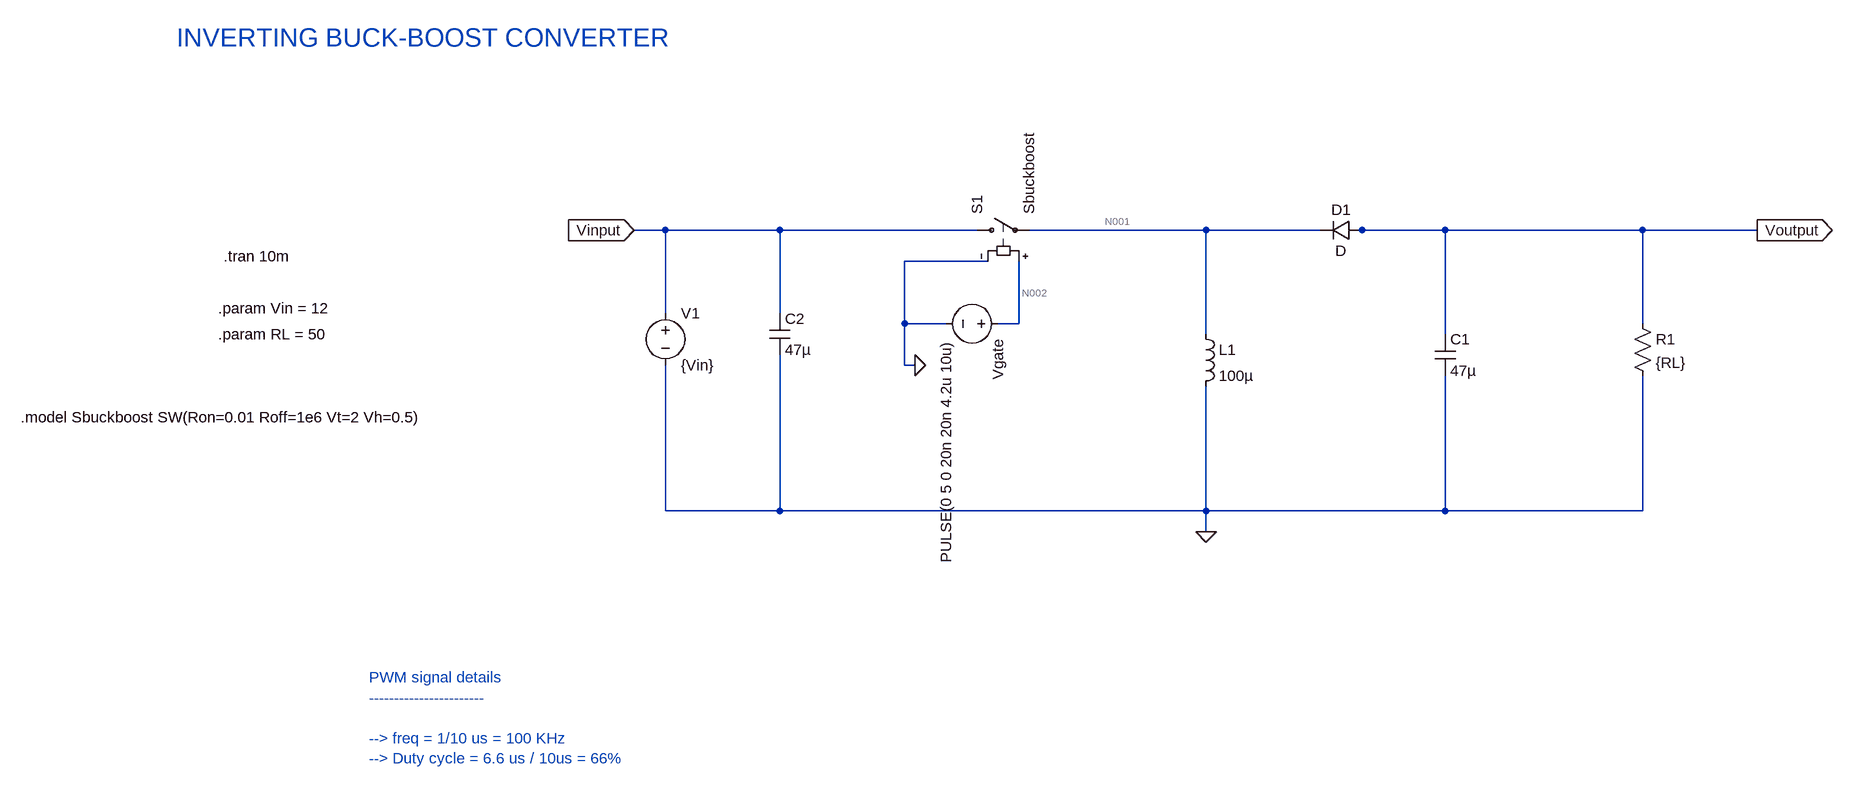
[diagram p0: schematic Buck_Boost_converter.asc]
Buck_Boost_converter.asc, the LTspice schematic file:
Version 4.1
SHEET 1 1880 1320
WIRE -368 0 -416 0
WIRE -192 0 -368 0
WIRE 112 0 -192 0
WIRE 464 0 192 0
WIRE 640 0 464 0
WIRE 704 0 688 0
WIRE 832 0 704 0
WIRE 1136 0 832 0
WIRE 1312 0 1136 0
WIRE 128 48 0 48
WIRE -368 128 -368 0
WIRE -192 128 -192 0
WIRE 0 144 0 48
WIRE 64 144 0 144
WIRE 176 144 176 48
WIRE 176 144 144 144
WIRE 1136 144 1136 0
WIRE 464 160 464 0
WIRE 832 160 832 0
WIRE 0 208 0 144
WIRE 16 208 0 208
WIRE -368 432 -368 208
WIRE -192 432 -192 192
WIRE -192 432 -368 432
WIRE 464 432 464 240
WIRE 464 432 -192 432
WIRE 832 432 832 224
WIRE 832 432 464 432
WIRE 1136 432 1136 224
WIRE 1136 432 832 432
WIRE 464 464 464 432
FLAG 464 464 0
FLAG 1312 0 Voutput
IOPIN 1312 0 Out
FLAG -416 0 Vinput
IOPIN -416 0 In
FLAG 16 208 0
SYMBOL voltage -368 112 R0
WINDOW 123 0 0 Left 0
WINDOW 39 0 0 Left 0
SYMATTR InstName V1
SYMATTR Value {Vin}
SYMBOL sw 96 0 R270
SYMATTR InstName S1
SYMATTR Value Sbuckboost
SYMBOL ind 448 144 R0
SYMATTR InstName L1
SYMATTR Value 100µ
SYMATTR SpiceLine Ipk=10.1 Rser=0.02752 Rpar=9420 Cpar=0 mfg="Coilcraft" pn="PCV-2-104-10"
SYMBOL cap 816 160 R0
SYMATTR InstName C1
SYMATTR Value 47µ
SYMBOL res 1120 128 R0
SYMATTR InstName R1
SYMATTR Value {RL}
SYMBOL voltage 160 144 R90
WINDOW 123 0 0 Left 0
WINDOW 39 0 0 Left 0
SYMATTR InstName Vgate
SYMATTR Value PULSE(0 5 0 20n 20n 4.2u 10u)
SYMBOL cap -208 128 R0
SYMATTR InstName C2
SYMATTR Value 47µ
SYMBOL diode 704 -16 R90
WINDOW 0 0 32 VBottom 2
WINDOW 3 32 32 VTop 2
SYMATTR InstName D1
TEXT -824 688 Left 2 ;PWM signal details\n-----------------------\n \n--> freq = 1/10 us = 100 KHz\n--> Duty cycle = 6.6 us / 10us = 66%
TEXT -1120 -296 Left 4 ;INVERTING BUCK-BOOST CONVERTER
TEXT -1048 40 Left 2 !.tran 10m
TEXT -1056 120 Left 2 !.param Vin = 12
TEXT -1056 160 Left 2 !.param RL = 50
TEXT -1360 288 Left 2 !.model Sbuckboost SW(Ron=0.01 Roff=1e6 Vt=2 Vh=0.5)

The netlist it stands for:
* Buck_Boost_converter.asc
V1 Vinput 0 {Vin}
S1 Vinput N001 N002 0 Sbuckboost
L1 N001 0 100µ Ipk=10.1 Rser=0.02752 Rpar=9420 Cpar=0 mfg="Coilcraft" pn="PCV-2-104-10"
C1 Voutput 0 47µ
R1 Voutput 0 {RL}
Vgate N002 0 PULSE(0 5 0 20n 20n 4.2u 10u)
C2 Vinput 0 47µ
D1 Voutput N001 D
.model D D
.lib standard.dio
* PWM signal details
* -----------------------
* --> freq = 1/10 us = 100 KHz
* --> Duty cycle = 6.6 us / 10us = 66%
* INVERTING BUCK-BOOST CONVERTER
.tran 10m
.param Vin = 12
.param RL = 50
.model Sbuckboost SW(Ron=0.01 Roff=1e6 Vt=2 Vh=0.5)
.backanno
.end

* Results of the author's LTspice run, read from the files saved beside the schematic
* Operating Point, zero values left out:
*   V(n001) = 330.2 nV
*   V(vinput) = 12 V
*   I(V1) = -12 µA
*   I(L1) = 12 µA
*   I(S1) = -12 µA
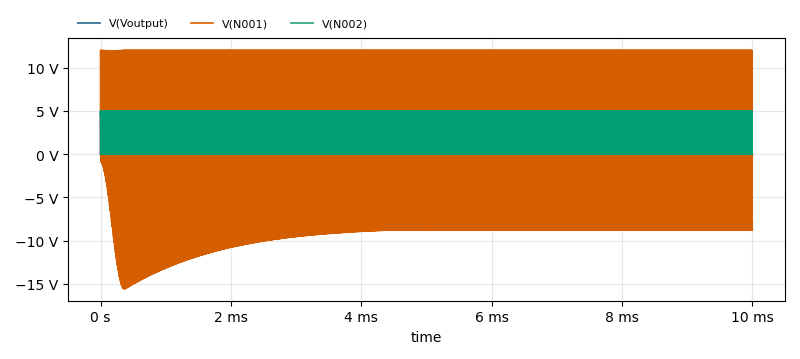
[diagram p1: Transient Analysis of Buck_Boost_converter.asc, plotted from the saved traces]
* Transient Analysis, 1 run:
*   V(Voutput): min -14.76 V, max 0 V, average -8.784 V, rms 8.979 V, last -7.98 V
*   V(N001): min -15.56 V, max 12 V, average 12.97 mV, rms 10.47 V, last -8.718 V
*   V(N002): min 0 V, max 5 V, average 2.11 V, rms 3.246 V, last 0 V